# Altium project BaseController.PrjPcb
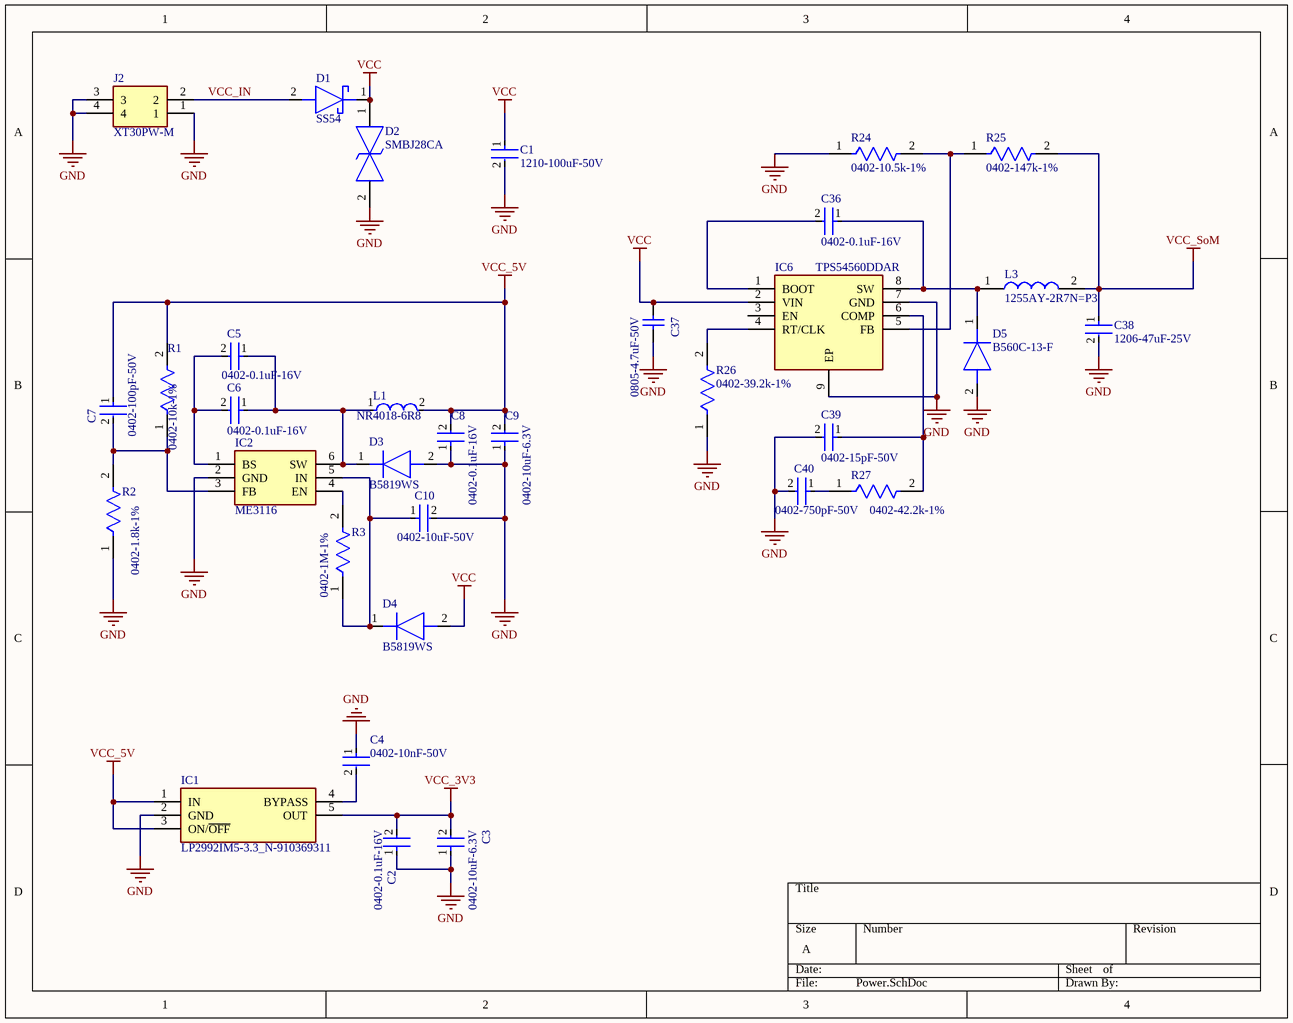
[diagram p0: Power.SchDoc]
5 sheets, 112 parts. Net scope: flat (ports and power ports of the same name join across sheets).
Board file: PCB2.PcbDoc
Sheets:
  Power.SchDoc
  ESP32.SchDoc
  CAN-POWER-B2B.SchDoc
  USB-PROG-UART.SchDoc
  Ethernet-PHY.SchDoc

## Sheet Power.SchDoc
size A; SheetNumber: 1; SheetTotal: 5

### Parts
C1  1210-100uF-50V  [FP-1210-L_3_3_0_4-W_2_5_0-IPC_B]
C2  0402-0.1uF-16V  [FP-GRM155-0_05-IPC_A]
C3  0402-10uF-6.3V  [FP-GRM155-0_05-IPC_A]
C4  0402-10nF-50V  [FP-GRM155-0_05-IPC_A]
C5  0402-0.1uF-16V  [FP-GRM155-0_05-IPC_A]
C6  0402-0.1uF-16V  [FP-GRM155-0_05-IPC_A]
C7  0402-100pF-50V  [FP-GRM155-0_05-IPC_A]
C8  0402-0.1uF-16V  [FP-GRM155-0_05-IPC_A]
C9  0402-10uF-6.3V  [FP-GRM155-0_05-IPC_A]
C10  0402-10uF-50V  [FP-GRM155-0_05-IPC_A]
C36  0402-0.1uF-16V  [FP-GRM155-0_05-IPC_A]
C37  0805-4.7uF-50V  [CAPC2013X88X50LL20T25]
C38  1206-47uF-25V  [FP-C3216-160-0_3-IPC_C]
C39  0402-15pF-50V  [FP-GRM155-0_05-IPC_A]
C40  0402-750pF-50V  [FP-GRM155-0_05-IPC_A]
D1  SS54  [DIOM5026X262N]
D2  SMBJ28CA  [DIONM5436X244N]
D3  B5819WS  [SOD2613X100N]
D4  B5819WS  [SOD2613X100N]
D5  B560C-13-F  [DIOM7959X250N]
IC1  LP2992IM5-3.3_N-910369311  [SOT95P280X145-5N]
IC2  ME3116  [SOT95P270X145-6N]
IC6  TPS54560DDAR  [SOIC127P600X170-9N]
J2  XT30PW-M  [XT30PWM]
L1  NR4018-6R8  [FP-NR4018-MFG]
L3  1255AY-2R7N=P3  [1255AY100MP3]
R1  0402-10k-1%  [FP-CRCW0402-e3-IPC_C]
R2  0402-1.8k-1%  [FP-CRCW0402-e3-IPC_C]
R3  0402-1M-1%  [FP-CRCW0402-e3-IPC_C]
R24  0402-10.5k-1%  [FP-CRCW0402-e3-IPC_C]
R25  0402-147k-1%  [FP-CRCW0402-e3-IPC_C]
R26  0402-39.2k-1%  [FP-CRCW0402-e3-IPC_C]
R27  0402-42.2k-1%  [FP-CRCW0402-e3-IPC_C]

### Nets
GND: C1.2 C2.1 C3.1 C4.1 C8.1 C9.1 C10.2 C37.1 C38.2 C39.2 C40.2 D2.2 D3.2(A) D5.2(A) IC1.2(GND) IC2.2(GND) IC6.7(GND) IC6.9(EP) J2.1 J2.3 J2.4 R2.1 R24.1 R26.1
VCC: C1.1 C37.2 D1.1(K) D2.1 D4.2(A) IC6.2(VIN)
VCC_3V3: C2.2 C3.2 IC1.5(OUT)
VCC_5V: C7.1 C8.2 C9.2 IC1.1(IN) IC1.3(ON/~{OFF}) L1.2 R1.2
VCC_SoM: C38.1 L3.2 R25.2
VCC_IN: D1.2(A) J2.2
NetC4_2: C4.2 IC1.4(BYPASS)
NetC5_1: C5.1 C6.1 D3.1(K) IC2.6(SW) L1.1
NetC5_2: C5.2 C6.2 IC2.1(BS)
NetC7_2: C7.2 IC2.3(FB) R1.1 R2.2
NetC10_1: C10.1 D4.1(K) IC2.5(IN) R3.1
NetC36_1: C36.1 D5.1(K) IC6.8(SW) L3.1
NetC36_2: C36.2 IC6.1(BOOT)
NetC39_1: C39.1 IC6.6(COMP) R27.2
NetC40_1: C40.1 R27.1
NetIC2_4: IC2.4(EN) R3.2
NetIC6_4: IC6.4(RT/CLK) R26.2
NetIC6_5: IC6.5(FB) R24.2 R25.1

Not connected (* = marked no-connect by the designer): IC6 3(EN)

### Library data of the parts
C1 = CMP-04427-007940-1: General Purpose Ceramic Capacitor, 1210, 22uF, 10%, X7R, 15%, 16V; Voltage: 10V; Insulation Resistance: 100GR; Dissipation Factor: 3.5%; REACH SVHC: No SVHC; Lead Free: Lead Free; Length: 3.2mm; Termination: SMD/SMT; Voltage Rating (DC): 16V; Radiation Hardening: No; RoHS Compliant: Yes; Case/Package: 1210; Case Code (Metric): 3225; Capacitance: 22uF; Width: 0.098inch; Packaging: Tape and Reel; Dielectric: X7R; Min Operating Temperature: -55°C; Max Operating Temperature: 125°C; Package Quantity: 1000; Series: Standard; Thickness: 0.11inch; Contact Plating: Tin; Tolerance: 10%; Height: 2.79mm; Mount: Surface Mount; Case Code (Imperial): 1210; Depth: 2.5mm; Voltage Rating: 16V; Number of Pins: 2; Construction: Flat
C2-C10 C36 C39 C40 = CMP-2008-04561-5: CAP CER 0.22UF 10V X5R 0402; Tolerance: 10%; Capacitance: 220nF; Material: Ceramic; Insulation Resistance: 10GR; Package Quantity: 1; Termination: SMD/SMT; Max Operating Temperature: 85°C; Voltage: 10V; REACH SVHC: No SVHC; Thickness: 0.022inch; Mount: Surface Mount; Height: 0.5mm; Length: 1mm; Lead Free: Lead Free; Number of Pins: 2; Case Code (Imperial): 0402; Case/Package: 0402; Min Operating Temperature: -55°C; Packaging: Tape and Reel; Dielectric: X5R; Depth: 0.5mm; Series: GRM; Case Code (Metric): 1005; Radiation Hardening: No; RoHS Compliant: Yes; Voltage Rating (DC): 10V; Voltage Rating: 10V; Dielectric Material: Ceramic; Width: 0.5mm
C37 = CMP-2007-00266-1: Manufacturer: Kemet; Part Number: C0805C103K5RACTU
C38 = CMP-2000-05396-3: Multilayer Ceramic Capacitors 100uF ±20% 10V X5R SMD 1206; Voltage Rating (DC): 10V; Length: 3.2mm; Mount: Surface Mount; Depth: 1.6mm; Width: 1.6mm; Package Quantity: 1; Min Operating Temperature: -55°C; Packaging: Tape and Reel; Max Operating Temperature: 85°C; Dielectric: X5R; Construction: Flat; Case Code (Imperial): 1206; Capacitance: 100uF; Thickness: 0.075inch; Radiation Hardening: No; RoHS Compliant: Yes; Series: C; Dielectric Material: Ceramic; Voltage: 10V; REACH SVHC: No SVHC; Case Code (Metric): 3216; Weight: 0.000571oz; Height: 1.6mm; Voltage Rating: 10V; Termination: SMD/SMT; Lead Free: Lead Free; Tolerance: 20%; Case/Package: 1206; Resistor Type: Ceramic
D1 = SS54: Schottky Diode; Manufacturer_Name: DIYI Elec Tech; Datasheet Link: https://datasheet.lcsc.com/szlcsc/DIYI-Elec-Tech-SS54_C84165.pdf; Height: 2.62mm; Manufacturer_Part_Number: SS54
D2 = SMBJ28CA: TVS Diode (Bi-directional); Manufacturer_Name: Bourns; Datasheet Link: https://componentsearchengine.com/Datasheets/1/SMBJ28CA.pdf; Height: 2.44mm; Manufacturer_Part_Number: SMBJ28CA; Mouser Part Number: 652-SMBJ28CA; Mouser Price/Stock: https://www.mouser.co.uk/ProductDetail/Bourns/SMBJ28CA?qs=d7fLapxX37FKb4yeAvm1Vg%3D%3D; Arrow Part Number: SMBJ28CA; Arrow Price/Stock: https://www.arrow.com/en/products/smbj28ca/bourns?region=nac
D3 D4 = B5819WS: Diode; Manufacturer_Name: Yangzhou Yangjie Electronic Technology Co.; Datasheet Link: https://www.21yangjie.com/ggs/xxh/xxhxtdejg/B5817WS%20THRU%20B5819WS-SOD-323-%E6%B5%B7%E9%B8%A5%E8%84%9A.pdf; Height: 1mm; Manufacturer_Part_Number: B5819WS
D5 = B560C-13-F: Diode; Manufacturer_Name: Diodes Inc.; Datasheet Link: https://datasheet.lcsc.com/szlcsc/Diodes-Incorporated-B560C-13-F_C85100.pdf; Height: 2.5mm; Manufacturer_Part_Number: B560C-13-F; Mouser Part Number: 621-B560C-F; Mouser Price/Stock: https://www.mouser.co.uk/ProductDetail/Diodes-Incorporated/B560C-13-F?qs=OC0R%252Bhozcm%252BAsjMXklZLIw%3D%3D; Arrow Part Number: B560C-13-F; Arrow Price/Stock: https://www.arrow.com/en/products/b560c-13-f/diodes-incorporated?region=nac
IC1 = LP2992IM5-3.3_N-910369311: Integrated Circuit; Manufacturer_Name: Texas Instruments; Manufacturer_Part_Number: LP2992IM5-3.3/N-910369311; Datasheet Link: https://www.arrow.com/en/products/lp2992im5-3.3n-910369311/texas-instruments; Height: 1.45mm; Arrow Part Number: LP2992IM5-3.3/N-910369311; Arrow Price/Stock: https://www.arrow.com/en/products/lp2992im5-3.3n-910369311/texas-instruments
IC2 = ME3116: Integrated Circuit; Manufacturer_Name: Microne; Datasheet Link: https://datasheet.lcsc.com/szlcsc/Nanjing-Micro-One-Elec-ME3116_C97643.pdf; Height: 1.45mm; Manufacturer_Part_Number: ME3116
IC6 = TPS54560DDAR: Integrated Circuit; Manufacturer_Name: Texas Instruments; Datasheet Link: http://www.ti.com/lit/ds/symlink/tps54560.pdf; Height: 1.7mm; Manufacturer_Part_Number: TPS54560DDAR; Mouser Part Number: 595-TPS54560DDAR; Mouser Price/Stock: https://www.mouser.co.uk/ProductDetail/Texas-Instruments/TPS54560DDAR?qs=%2FA2SZCkL4Tlm1gC5t8ZNIg%3D%3D; Arrow Part Number: TPS54560DDAR; Arrow Price/Stock: https://www.arrow.com/en/products/tps54560ddar/texas-instruments?region=nac
J2 = XT30PW-M: Connector; Manufacturer_Name: Amass; Datasheet Link: https://www.tme.eu/sl/Document/ce4077e36b79046da520ca73227e15de/XT30PW%20SPEC.pdf; Height: 5mm; Manufacturer_Part_Number: XT30PW-M
L1 = CMP-14484-000658-1: SMD Power Inductors 2.2uH ±20% 1.44A 72mΩ; Shielding: Shielded; Self Resonant Frequency: 52MHz; Core Material: Ferrite; Saturation Current: 2.7A; DC Resistance (DCR): 72mR; Test Frequency: 100kHz; Current Rating: 1.44A; Inductance: 2.2uH; RoHS Compliant: Yes; Inductance Tolerance: 20%; Max DC Current: 1.44A; Package Quantity: 3500; Termination: SMD/SMT; Width: 4mm; Tolerance: 20%; Case/Package: 1515; Lead Free: Lead Free; Height: 1.8mm; Resistor Type: Wirewound; Packaging: Tape and Reel; Mount: Surface Mount; Min Operating Temperature: -25°C; Max Operating Temperature: 120°C; Number of Pins: 2; Series: NR; RMS Current (Irms): 1.44A; Height - Seated (Max): 0.071inch; Length: 0.157inch; Halogen Free: Halogen Free
L3 = 1255AY-2R7N=P3: Inductor; Manufacturer_Name: Murata Electronics; Datasheet Link: https://psearch.en.murata.com/inductor/product/1255AY-2R7N%23.html; Height: 4.5mm; Manufacturer_Part_Number: 1255AY-2R7N=P3; Mouser Part Number: 81-1255AY-2R7NP3; Mouser Price/Stock: https://www.mouser.co.uk/ProductDetail/Murata-Electronics/1255AY-2R7N%3dP3?qs=KuGPmAKtFKXDux1CpeRnvg%3D%3D; Arrow Part Number: 1255AY-2R7N=P3; Arrow Price/Stock: https://www.arrow.com/en/products/1255ay-2r7np3/murata-manufacturing
R1-R3 R24-R27 = CMP-2002-08122-2: RES Thick Film, 0Ω, 0.063W, 0402; Tolerance: 5%; Max Power Dissipation: 63mW; Voltage Rating: 50V; Temperature Coefficient: 100ppm/°C; Resistance: 0mR; Contact Plating: Tin; Height: 0.35mm; Radiation Hardening: No; Features: Automotive AEC-Q200; Composition: Thick Film; Width: 0.5mm; Weight: 2.3E-05oz; Termination: SMD/SMT; Packaging: Tape and Reel; Mount: Surface Mount; Case Code (Metric): 1005; Military Standard: Not; Min Operating Temperature: -55°C; Number of Terminations: 2; Package Quantity: 1; Case Code (Imperial): 0402; Depth: 0.5mm; Max Operating Temperature: 155°C; Case/Package: 0402; Power Rating: 63mW; Lead Free: Lead Free; Voltage Rating (DC): 50V; Length: 1mm

## Sheet ESP32.SchDoc
size A; SheetNumber: 2; SheetTotal: 5
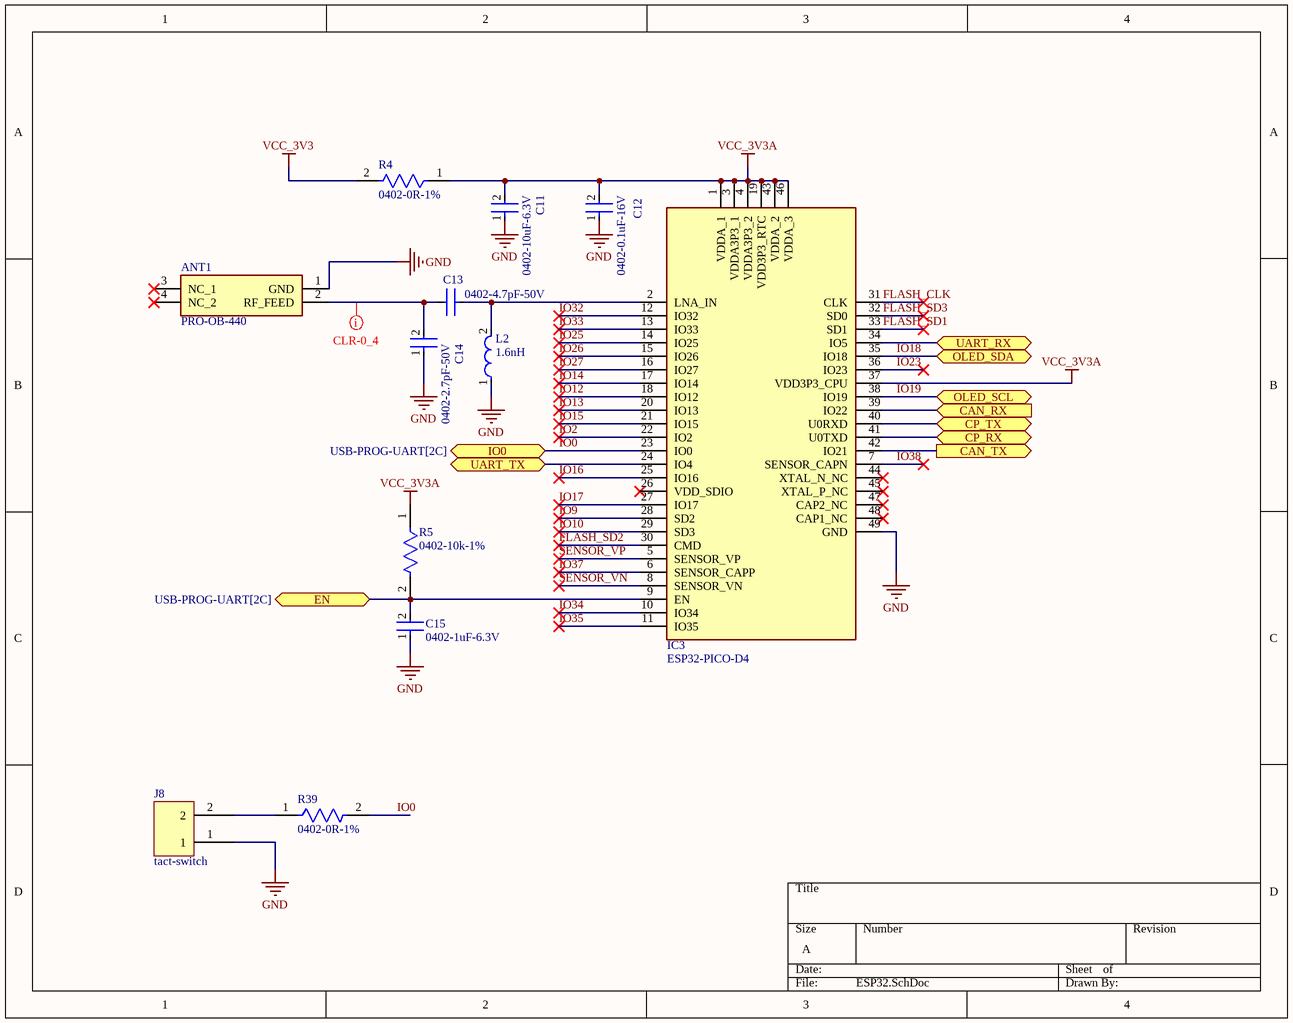
[diagram p1: ESP32.SchDoc]

### Parts
ANT1  PRO-OB-440  [PRO-OB-440_1]
C11  0402-10uF-6.3V  [FP-GRM155-0_05-IPC_A]
C12  0402-0.1uF-16V  [FP-GRM155-0_05-IPC_A]
C13  0402-4.7pF-50V  [FP-GRM155-0_05-IPC_A]
C14  0402-2.7pF-50V  [FP-GRM155-0_05-IPC_A]
C15  0402-1uF-6.3V  [FP-GRM155-0_05-IPC_A]
IC3  ESP32-PICO-D4  [ESP32PICOD4]
J8  tact-switch  [tact-switch]
L2  1.6nH  [FP-LQW15AN_00-W0_6-0_1-MFG]
R4  0402-0R-1%  [FP-CRCW0402-e3-IPC_C]
R5  0402-10k-1%  [FP-CRCW0402-e3-IPC_C]
R39  0402-0R-1%  [FP-CRCW0402-e3-IPC_C]

### Ports
CAN_RX (in, see CAN-POWER-B2B[1C]), CAN_TX (out, see CAN-POWER-B2B[1C]), CP_RX (bidir, see USB-PROG-UART[4A]), CP_TX (bidir, see USB-PROG-UART[4A]), EN (bidir, see USB-PROG-UART[2C]), IO0 (bidir, see USB-PROG-UART[2C]), OLED_SCL (bidir, see CAN-POWER-B2B[3C]), OLED_SDA (bidir, see CAN-POWER-B2B[3C]), UART_RX (bidir, see CAN-POWER-B2B[4B]), UART_TX (bidir, see CAN-POWER-B2B[4B])

### Nets
GND: ANT1.1(GND) C11.1 C12.1 C14.1 C15.1 IC3.49(GND) J8.1 L2.1
VCC_3V3: R4.2
VCC_3V3A: C11.2 C12.2 IC3.1(VDDA_1) IC3.3(VDDA3P3_1) IC3.4(VDDA3P3_2) IC3.19(VDD3P3_RTC) IC3.37(VDD3P3_CPU) IC3.43(VDDA_2) IC3.46(VDDA_3) R4.1 R5.1
FLASH_CLK: IC3.31(CLK)
FLASH_SD1: IC3.33(SD1)
FLASH_SD2: IC3.30(CMD)
FLASH_SD3: IC3.32(SD0)
IO0: IC3.23(IO0) R39.2 ; port IO0
IO2: IC3.22(IO2)
IO9: IC3.28(SD2)
IO10: IC3.29(SD3)
IO12: IC3.18(IO12)
IO13: IC3.20(IO13)
IO14: IC3.17(IO14)
IO15: IC3.21(IO15)
IO16: IC3.25(IO16)
IO17: IC3.27(IO17)
IO18: IC3.35(IO18) ; port OLED_SDA
IO19: IC3.38(IO19) ; port OLED_SCL
IO23: IC3.36(IO23)
IO25: IC3.14(IO25)
IO26: IC3.15(IO26)
IO27: IC3.16(IO27)
IO32: IC3.12(IO32)
IO33: IC3.13(IO33)
IO34: IC3.10(IO34)
IO35: IC3.11(IO35)
IO37: IC3.6(SENSOR_CAPP)
IO38: IC3.7(SENSOR_CAPN)
SENSOR_VN: IC3.8(SENSOR_VN)
SENSOR_VP: IC3.5(SENSOR_VP)
UART_RX: IC3.34(IO5) ; port UART_RX
UART_TX: IC3.24(IO4) ; port UART_TX
NetANT1_2: ANT1.2(RF_FEED) C13.2 C14.2
NetC13_1: C13.1 IC3.2(LNA_IN) L2.2
NetC15_2: C15.2 IC3.9(EN) R5.2 ; port EN
NetIC3_39: IC3.39(IO22) ; port CAN_RX
NetIC3_40: IC3.40(U0RXD) ; port CP_TX
NetIC3_41: IC3.41(U0TXD) ; port CP_RX
NetIC3_42: IC3.42(IO21) ; port CAN_TX
NetJ8_2: J8.2 R39.1

Not connected (* = marked no-connect by the designer): ANT1 3(NC_1)* 4(NC_2)*; IC3 26(VDD_SDIO)* 44(XTAL_N_NC)* 45(XTAL_P_NC)* 47(CAP2_NC)* 48(CAP1_NC)*

### Layout directives
net class CLR-0_4: NetANT1_2

### Library data of the parts
ANT1 = PRO-OB-440: Antenna; Manufacturer_Name: Proant AB; Datasheet Link: https://datasheet.datasheetarchive.com/originals/distributors/Datasheets_SAMA/948dc430b75246ce8cd38483dfecf2eb.pdf; Manufacturer_Part_Number: PRO-OB-440
C11-C15 = CMP-2008-04561-5: as C2 on sheet Power; Package Quantity: 1; Termination: SMD/SMT; Max Operating Temperature: 85°C; Voltage: 10V; REACH SVHC: No SVHC; Thickness: 0.022inch; Mount: Surface Mount; Height: 0.5mm; Length: 1mm; Lead Free: Lead Free; Number of Pins: 2; Case Code (Imperial): 0402; Case/Package: 0402; Min Operating Temperature: -55°C; Packaging: Tape and Reel; Dielectric: X5R; Depth: 0.5mm; Series: GRM; Case Code (Metric): 1005; Radiation Hardening: No; RoHS Compliant: Yes; Voltage Rating (DC): 10V; Voltage Rating: 10V; Dielectric Material: Ceramic; Width: 0.5mm
IC3 = ESP32-PICO-D4: Integrated Circuit; Manufacturer_Name: Espressif Systems; Datasheet Link: https://www.espressif.com/sites/default/files/documentation/esp32-pico-d4_datasheet_en.pdf; Height: 1.04mm; Manufacturer_Part_Number: ESP32-PICO-D4; Mouser Part Number: 356-ESP32-PICO-D4; Mouser Price/Stock: https://www.mouser.co.uk/ProductDetail/Espressif-Systems/ESP32-PICO-D4?qs=MLItCLRbWsw7MJlbN3HfdA%3D%3D
L2 = CMP-06042-000827-1: Wire Wound RF Inductor 3.9nH ±0.1nH 750mA 0.07Ω 0402 (1005); Shielding: Unshielded; Self Resonant Frequency: 10GHz; Core Material: Air; Test Frequency: 100MHz; DC Resistance (DCR): 70mR; Length: 1mm; Inductance: 3.9nH; Height: 0.5mm; Case Code (Metric): 1005; Lead Free: Lead Free; Military Standard: Not; Mount: Surface Mount; Current: 750mA; REACH SVHC: No SVHC; Current Rating: 750mA; DC Current: 750mA; Max Operating Temperature: 125°C; Package Quantity: 10000; Packaging: Tape and Reel; Case/Package: 0402; Min Operating Temperature: -55°C; Width: 0.02inch; Depth: 0.7mm; Termination: SMD/SMT; Weight: 2.8E-05oz; Number of Pins: 2; Radiation Hardening: No; Max DC Current: 750mA; Case Code (Imperial): 0402
R4 R5 R39 = CMP-2002-08122-2: as R1 on sheet Power; Contact Plating: Tin; Height: 0.35mm; Radiation Hardening: No; Features: Automotive AEC-Q200; Composition: Thick Film; Width: 0.5mm; Weight: 2.3E-05oz; Termination: SMD/SMT; Packaging: Tape and Reel; Mount: Surface Mount; Case Code (Metric): 1005; Military Standard: Not; Min Operating Temperature: -55°C; Number of Terminations: 2; Package Quantity: 1; Case Code (Imperial): 0402; Depth: 0.5mm; Max Operating Temperature: 155°C; Case/Package: 0402; Power Rating: 63mW; Lead Free: Lead Free; Voltage Rating (DC): 50V; Length: 1mm

## Sheet CAN-POWER-B2B.SchDoc
size A; SheetNumber: 3; SheetTotal: 5
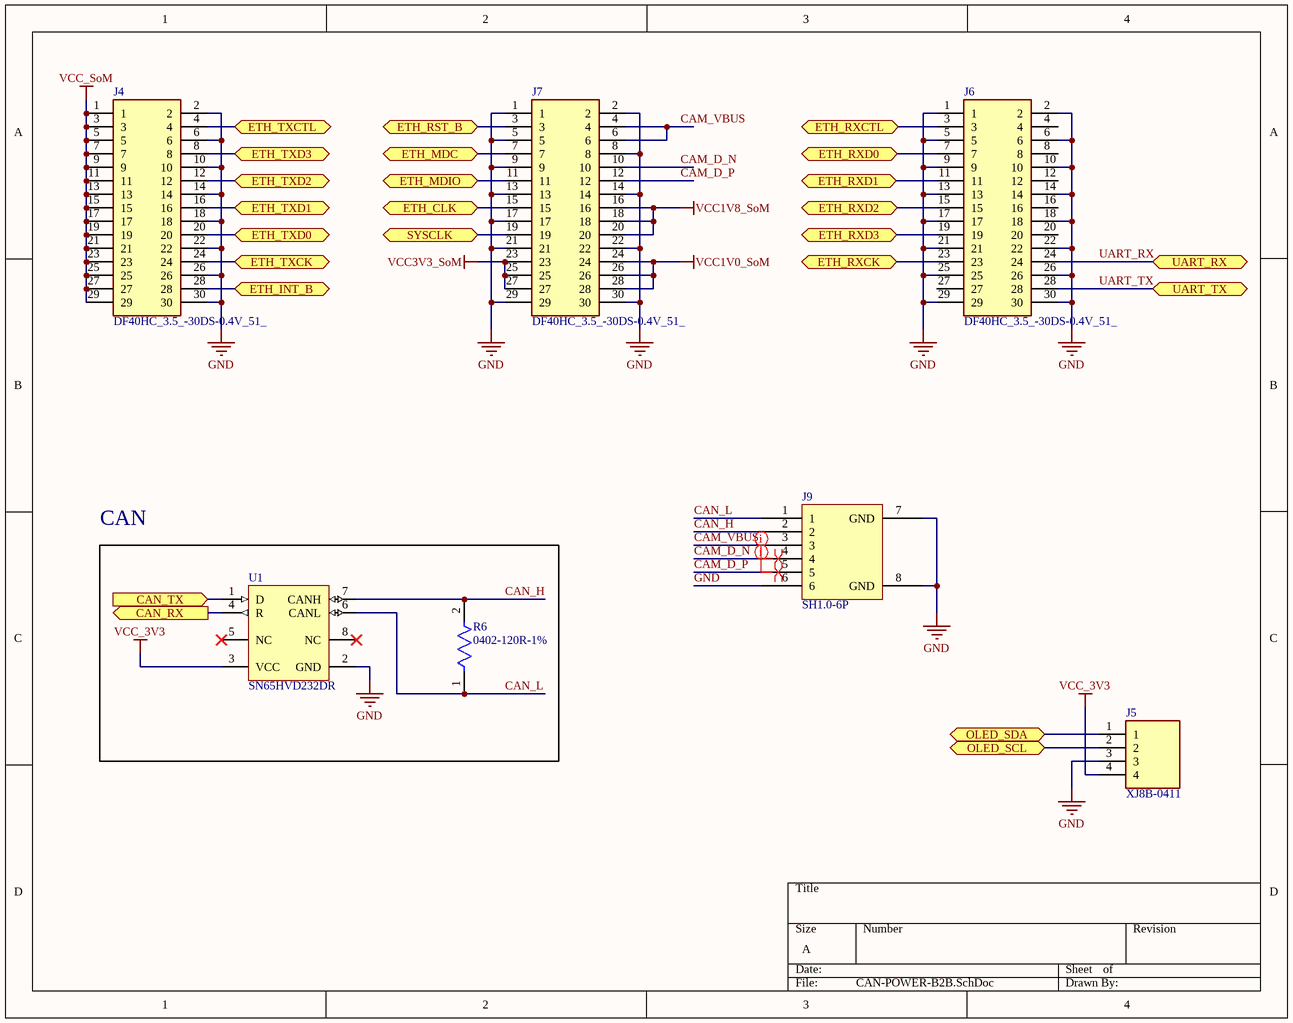
[diagram p2: CAN-POWER-B2B.SchDoc]

### Parts
J4  DF40HC_3.5_-30DS-0.4V_51_  [DF40HC3530DS04V51]
J5  XJ8B-0411  [HDRV4W64P0X254_1X4_1020X250X580P]
J6  DF40HC_3.5_-30DS-0.4V_51_  [DF40HC3530DS04V51]
J7  DF40HC_3.5_-30DS-0.4V_51_  [DF40HC3530DS04V51]
J9  SH1.0-6P  [SH1.0-6P]
R6  0402-120R-1%  [FP-CRCW0402-e3-IPC_C]
U1  SN65HVD232DR  [D0008A_M]

### Blocks framed on the sheet
CAN: R6 U1

### Ports
CAN_RX (out, see ESP32[3B]), CAN_TX (in, see ESP32[3B]), ETH_CLK (bidir, see Ethernet-PHY[1A]), ETH_INT_B (bidir, see Ethernet-PHY[1C]), ETH_MDC (bidir, see Ethernet-PHY[2B]), ETH_MDIO (bidir, see Ethernet-PHY[2B]), ETH_RST_B (bidir, see Ethernet-PHY[2B]), ETH_RXCK (bidir, see Ethernet-PHY[2D]), ETH_RXCTL (bidir, see Ethernet-PHY[2D]), ETH_RXD0 (bidir, see Ethernet-PHY[2D]), ETH_RXD1 (bidir, see Ethernet-PHY[2D]), ETH_RXD2 (bidir, see Ethernet-PHY[2D]), ETH_RXD3 (bidir, see Ethernet-PHY[2D]), ETH_TXCK (bidir, see Ethernet-PHY[2C]), ETH_TXCTL (bidir, see Ethernet-PHY[2C]), ETH_TXD0 (bidir, see Ethernet-PHY[2C]), ETH_TXD1 (bidir, see Ethernet-PHY[2C]), ETH_TXD2 (bidir, see Ethernet-PHY[2C]), ETH_TXD3 (bidir, see Ethernet-PHY[2C]), OLED_SCL (bidir, see ESP32[3B]), OLED_SDA (bidir, see ESP32[3B]), SYSCLK (bidir, see Ethernet-PHY[1A]), UART_RX (bidir, see ESP32[3B]), UART_TX (bidir, see ESP32[2B])

### Nets
GND: J4.2 J4.6 J4.10 J4.14 J4.18 J4.22 J4.26 J4.30 J5.3 J6.1 J6.2 J6.5 J6.6 J6.9 J6.10 J6.13 J6.14 J6.17 J6.18 J6.21 J6.22 J6.25 J6.26 J6.29 J6.30 J7.1 J7.2 J7.5 J7.8 J7.9 J7.13 J7.14 J7.17 J7.21 J7.22 J7.29 J7.30 J9.6 J9.7(GND) J9.8(GND) U1.2(GND)
VCC1V0_SoM: J7.24 J7.26 J7.28
VCC1V8_SoM: J7.16 J7.18 J7.20
VCC3V3_SoM: J7.23 J7.25 J7.27
VCC_3V3: J5.4 U1.3(VCC)
VCC_SoM: J4.1 J4.3 J4.5 J4.7 J4.9 J4.11 J4.13 J4.15 J4.17 J4.19 J4.21 J4.23 J4.25 J4.27 J4.29
CAM_D_N: J7.10 J9.4
CAM_D_P: J7.12 J9.5
CAM_VBUS: J7.4 J7.6 J9.3
CAN_H: J9.2 R6.2 U1.7(CANH)
CAN_L: J9.1 R6.1 U1.6(CANL)
ETH_CLK: J7.15 ; port ETH_CLK
ETH_INT_B: J4.28 ; port ETH_INT_B
ETH_MDC: J7.7 ; port ETH_MDC
ETH_MDIO: J7.11 ; port ETH_MDIO
ETH_RST_B: J7.3 ; port ETH_RST_B
ETH_RXCK: J6.23 ; port ETH_RXCK
ETH_RXCTL: J6.3 ; port ETH_RXCTL
ETH_RXD0: J6.7 ; port ETH_RXD0
ETH_RXD1: J6.11 ; port ETH_RXD1
ETH_RXD2: J6.15 ; port ETH_RXD2
ETH_RXD3: J6.19 ; port ETH_RXD3
ETH_TXCK: J4.24 ; port ETH_TXCK
ETH_TXCTL: J4.4 ; port ETH_TXCTL
ETH_TXD0: J4.20 ; port ETH_TXD0
ETH_TXD1: J4.16 ; port ETH_TXD1
ETH_TXD2: J4.12 ; port ETH_TXD2
ETH_TXD3: J4.8 ; port ETH_TXD3
IO18: J5.1 ; port OLED_SDA
IO19: J5.2 ; port OLED_SCL
SYSCLK: J7.19 ; port SYSCLK
UART_RX: J6.24 ; port UART_RX
UART_TX: J6.28 ; port UART_TX
NetIC3_39: U1.4(R) ; port CAN_RX
NetIC3_42: U1.1(D) ; port CAN_TX

Not connected (* = marked no-connect by the designer): J6 4 8 12 16 20 27; U1 5(NC)* 8(NC)*

### Layout directives
net class CAM_USB: CAM_D_N, CAM_D_P
differential pair: CAM_D_N, CAM_D_P

### Library data of the parts
J4 J6 J7 = DF40HC_3.5_-30DS-0.4V_51_: Connector; Manufacturer_Name: Hirose; Manufacturer_Part_Number: DF40HC(3.5)-30DS-0.4V(51); Datasheet Link: https://www.hirose.com/product/en/products/DF40/DF40HC%283.5%29-30DS-0.4V%2851%29/; Height: 3mm; Mouser Part Number: 798-DF40HC3530DS04V; Mouser Price/Stock: https://www.mouser.co.uk/ProductDetail/Hirose-Connector/DF40HC3.5-30DS-0.4V51?qs=sAMQa04WsV9vLKgcIJF7Vw%3D%3D
J5 = XJ8B-0411: Connector; Manufacturer_Name: Omron Electronics; Datasheet Link: https://www.omron.com/ecb/products/pdf/en-xj8.pdf; Height: 5.8mm; Manufacturer_Part_Number: XJ8B-0411; Mouser Part Number: 653-XJ8B0411; Mouser Price/Stock: https://www.mouser.co.uk/ProductDetail/Omron-Electronics/XJ8B-0411?qs=8ODJmtm206ec9SYet6om8g%3D%3D
R6 = CMP-2002-08122-2: as R1 on sheet Power; Contact Plating: Tin; Height: 0.35mm; Radiation Hardening: No; Features: Automotive AEC-Q200; Composition: Thick Film; Width: 0.5mm; Weight: 2.3E-05oz; Termination: SMD/SMT; Packaging: Tape and Reel; Mount: Surface Mount; Case Code (Metric): 1005; Military Standard: Not; Min Operating Temperature: -55°C; Number of Terminations: 2; Package Quantity: 1; Case Code (Imperial): 0402; Depth: 0.5mm; Max Operating Temperature: 155°C; Case/Package: 0402; Power Rating: 63mW; Lead Free: Lead Free; Voltage Rating (DC): 50V; Length: 1mm
U1 = CMP-0315-00075-2: 3.3 V Can Transceiver, 17 mA, -40 to 85 degC, 8-pin SOIC (D), Green (RoHS & no Sb/Br); Manufacturer: Texas Instruments; Supply Voltage(s)(V): 3.3; Receivers Per Package: 1; ICC(Max)(mA): 17; Rating: Catalog; Transient Pulse Protection(V): -25 to 25; Mounting Technology: Surface Mount; PartNumber: SN65HVD232DR; Code_JEDEC: MS-012AA; Eco-Plan: Green (RoHS & no Sb/Br); Isolated: No; SubFamily: CAN; Footprint: SN65HVD232; Drivers Per Package: 1; ComponentLink1URL: http://www.ti.com/general/docs/lit/getliterature.tsp?genericPartNumber=SN65HVD232&fileType=pdf; ComponentLink1Description: Datasheet; PackageDescription: 8-Pin Plastic Small Outline Integrated Circuit, 4.9 x 3.9 mm, Pitch 1.27 mm Pitch; PackageReference: D0008A; DatasheetVersion: SLOS346K; PackageVersion: revM, Jun-2011

## Sheet USB-PROG-UART.SchDoc
size A; SheetNumber: 4; SheetTotal: 5
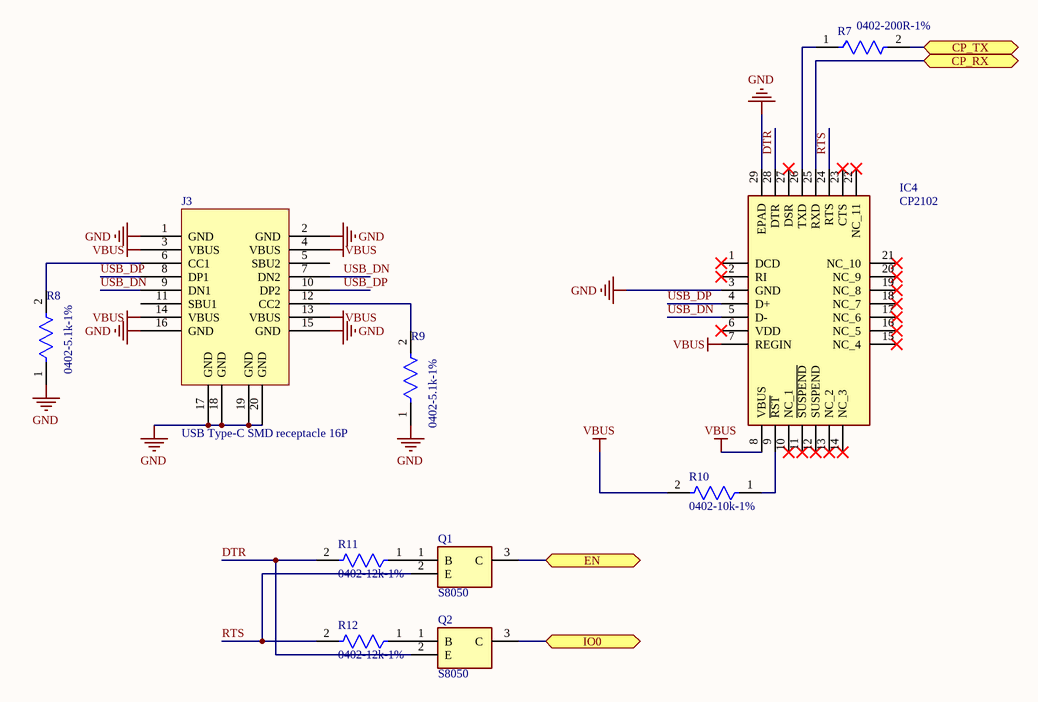
[diagram p3: USB-PROG-UART.SchDoc]

### Parts
IC4  CP2102  [QFN50P500X500X100-29N-D]
J3  USB Type-C SMD receptacle 16P  [USB Type-C SMD receptacle 16P]
Q1  S8050  [SOT95P240X115-3N]
Q2  S8050  [SOT95P240X115-3N]
R7  0402-200R-1%  [FP-CRCW0402-e3-IPC_C]
R8  0402-5.1k-1%  [FP-CRCW0402-e3-IPC_C]
R9  0402-5.1k-1%  [FP-CRCW0402-e3-IPC_C]
R10  0402-10k-1%  [FP-CRCW0402-e3-IPC_C]
R11  0402-12k-1%  [FP-CRCW0402-e3-IPC_C]
R12  0402-12k-1%  [FP-CRCW0402-e3-IPC_C]

### Ports
CP_RX (bidir, see ESP32[3B]), CP_TX (bidir, see ESP32[3B]), EN (bidir, see ESP32[1C]), IO0 (bidir, see ESP32[2B])

### Nets
GND: IC4.3(GND) IC4.29(EPAD) J3.1(GND) J3.2(GND) J3.15(GND) J3.16(GND) J3.17(GND) J3.18(GND) J3.19(GND) J3.20(GND) R8.1 R9.1
VBUS: IC4.7(REGIN) IC4.8(VBUS) J3.3(VBUS) J3.4(VBUS) J3.13(VBUS) J3.14(VBUS) R10.2
DTR: IC4.28(DTR) Q2.2(E) R11.2
IO0: Q2.3(C) ; port IO0
RTS: IC4.24(RTS) Q1.2(E) R12.2
USB_DN: IC4.5(D-) J3.7(DN2) J3.9(DN1)
USB_DP: IC4.4(D+) J3.8(DP1) J3.10(DP2)
NetC15_2: Q1.3(C) ; port EN
NetIC3_40: R7.2 ; port CP_TX
NetIC3_41: IC4.25(RXD) ; port CP_RX
NetIC4_9: IC4.9(~{RST}) R10.1
NetIC4_26: IC4.26(TXD) R7.1
NetJ3_6: J3.6(CC1) R8.2
NetJ3_12: J3.12(CC2) R9.2
NetQ1_1: Q1.1(B) R11.1
NetQ2_1: Q2.1(B) R12.1

Not connected (* = marked no-connect by the designer): IC4 1(DCD)* 2(RI)* 6(VDD)* 10(NC_1)* 11(~{SUSPEND})* 12(SUSPEND)* 13(NC_2)* 14(NC_3)* 15(NC_4)* 16(NC_5)* 17(NC_6)* 18(NC_7)* 19(NC_8)* 20(NC_9)* 21(NC_10)* 22(NC_11)* 23(CTS)* 27(DSR)*; J3 5(SBU2) 11(SBU1)

### Library data of the parts
IC4 = CP2102: Integrated Circuit; Manufacturer_Name: Silicon Labs; Datasheet Link: https://componentsearchengine.com/Datasheets/1/CP2102.pdf; Height: 1mm; Manufacturer_Part_Number: CP2102; Mouser Part Number: 634-CP2102; Mouser Price/Stock: https://www.mouser.co.uk/ProductDetail/Silicon-Labs/CP2102?qs=ucY0lxHzU7615lOm95XT0w%3D%3D
Q1 Q2 = S8050: Transistor; Manufacturer_Name: Yenji Elec; Datasheet Link: https://datasheet.lcsc.com/szlcsc/Yenji-Elec-S8050_C139514.pdf; Height: 1.15mm; Manufacturer_Part_Number: S8050
R7-R12 = CMP-2002-08122-2: as R1 on sheet Power; Contact Plating: Tin; Height: 0.35mm; Radiation Hardening: No; Features: Automotive AEC-Q200; Composition: Thick Film; Width: 0.5mm; Weight: 2.3E-05oz; Termination: SMD/SMT; Packaging: Tape and Reel; Mount: Surface Mount; Case Code (Metric): 1005; Military Standard: Not; Min Operating Temperature: -55°C; Number of Terminations: 2; Package Quantity: 1; Case Code (Imperial): 0402; Depth: 0.5mm; Max Operating Temperature: 155°C; Case/Package: 0402; Power Rating: 63mW; Lead Free: Lead Free; Voltage Rating (DC): 50V; Length: 1mm

## Sheet Ethernet-PHY.SchDoc
size A4; SheetNumber: 5; SheetTotal: 5
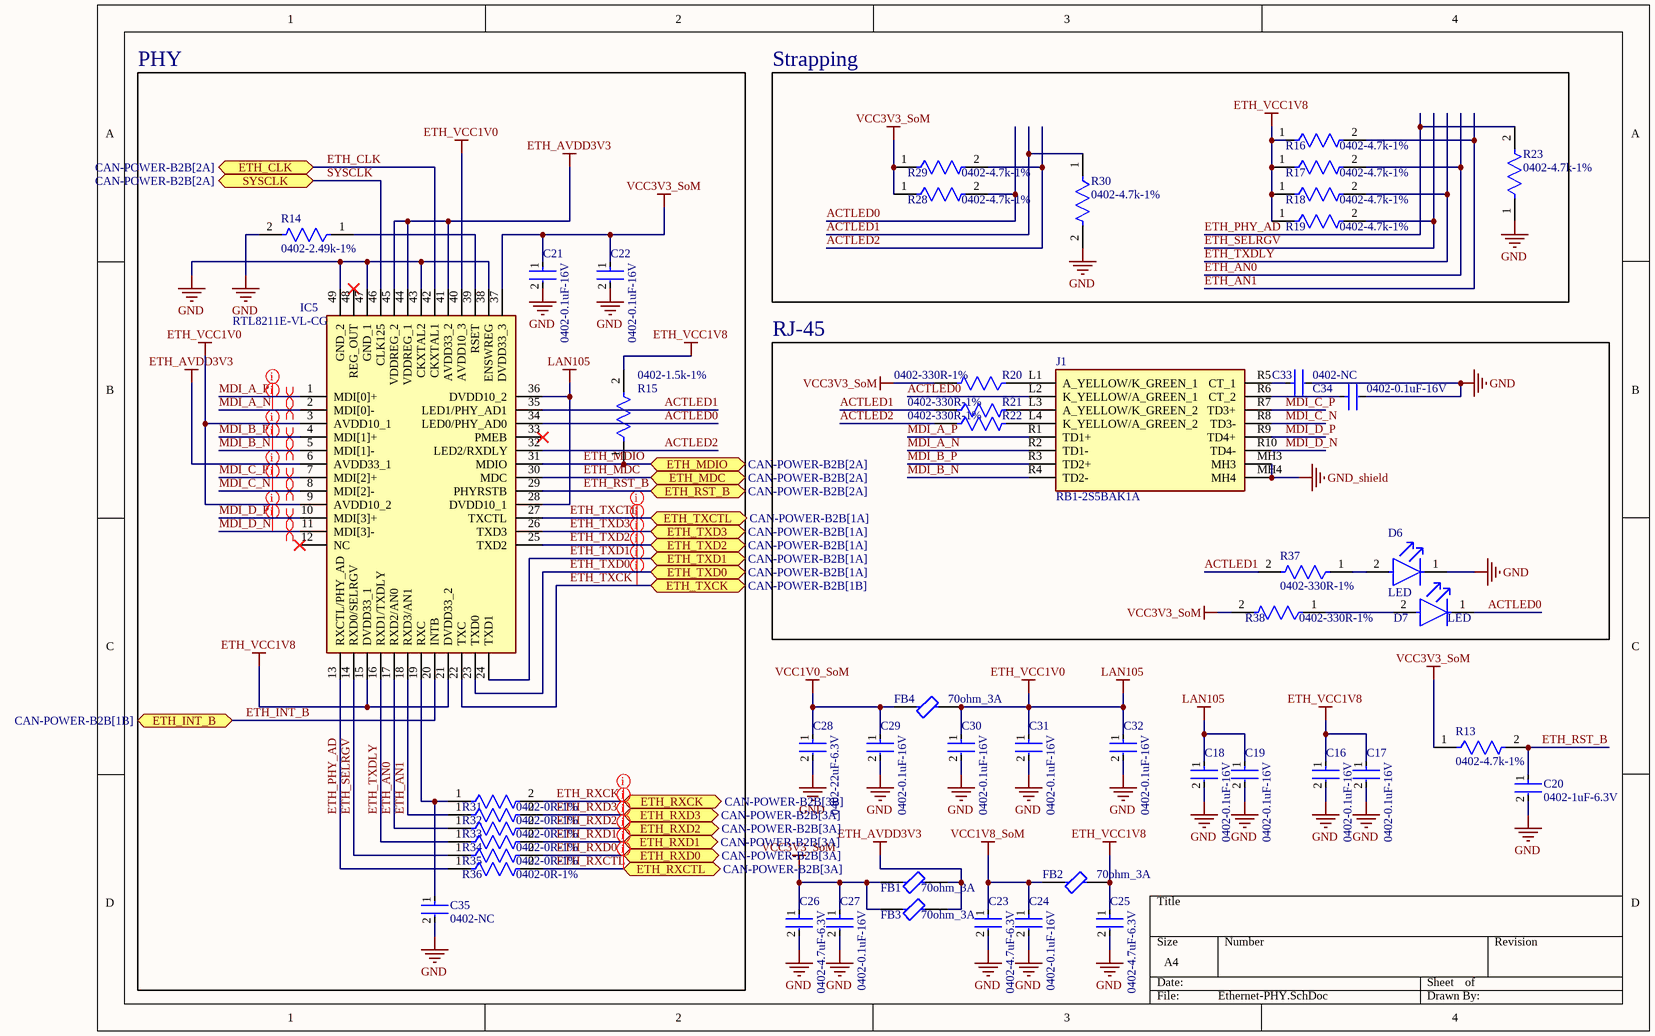
[diagram p4: Ethernet-PHY.SchDoc]

### Parts
C16  0402-0.1uF-16V  [FP-GRM155-0_05-IPC_A]
C17  0402-0.1uF-16V  [FP-GRM155-0_05-IPC_A]
C18  0402-0.1uF-16V  [FP-GRM155-0_05-IPC_A]
C19  0402-0.1uF-16V  [FP-GRM155-0_05-IPC_A]
C20  0402-1uF-6.3V  [FP-GRM155-0_05-IPC_A]
C21  0402-0.1uF-16V  [FP-GRM155-0_05-IPC_A]
C22  0402-0.1uF-16V  [FP-GRM155-0_05-IPC_A]
C23  0402-4.7uF-6.3V  [FP-GRM155-0_05-IPC_A]
C24  0402-0.1uF-16V  [FP-GRM155-0_05-IPC_A]
C25  0402-4.7uF-6.3V  [FP-GRM155-0_05-IPC_A]
C26  0402-4.7uF-6.3V  [FP-GRM155-0_05-IPC_A]
C27  0402-0.1uF-16V  [FP-GRM155-0_05-IPC_A]
C28  0402-22uF-6.3V  [FP-GRM155-0_05-IPC_A]
C29  0402-0.1uF-16V  [FP-GRM155-0_05-IPC_A]
C30  0402-0.1uF-16V  [FP-GRM155-0_05-IPC_A]
C31  0402-0.1uF-16V  [FP-GRM155-0_05-IPC_A]
C32  0402-0.1uF-16V  [FP-GRM155-0_05-IPC_A]
C33  0402-NC  [FP-GRM155-0_05-IPC_A]
C34  0402-0.1uF-16V  [FP-GRM155-0_05-IPC_A]
C35  0402-NC  [FP-GRM155-0_05-IPC_A]
D6  LED  [FP-APHHS1005CGCK-MFG]
D7  LED  [FP-APHHS1005CGCK-MFG]
FB1  70ohm_3A  [FP-MPZ2012-MFG]
FB2  70ohm_3A  [FP-MPZ2012-MFG]
FB3  70ohm_3A  [FP-MPZ2012-MFG]
FB4  70ohm_3A  [FP-MPZ2012-MFG]
IC5  RTL8211E-VL-CG  [QFN40P600X600X100-49N]
J1  RB1-2S5BAK1A  [RB12S5BAK1A]
R13  0402-4.7k-1%  [FP-CRCW0402-e3-IPC_C]
R14  0402-2.49k-1%  [FP-CRCW0402-e3-IPC_C]
R15  0402-1.5k-1%  [FP-CRCW0402-e3-IPC_C]
R16  0402-4.7k-1%  [FP-CRCW0402-e3-IPC_C]
R17  0402-4.7k-1%  [FP-CRCW0402-e3-IPC_C]
R18  0402-4.7k-1%  [FP-CRCW0402-e3-IPC_C]
R19  0402-4.7k-1%  [FP-CRCW0402-e3-IPC_C]
R20  0402-330R-1%  [FP-CRCW0402-e3-IPC_C]
R21  0402-330R-1%  [FP-CRCW0402-e3-IPC_C]
R22  0402-330R-1%  [FP-CRCW0402-e3-IPC_C]
R23  0402-4.7k-1%  [FP-CRCW0402-e3-IPC_C]
R28  0402-4.7k-1%  [FP-CRCW0402-e3-IPC_C]
R29  0402-4.7k-1%  [FP-CRCW0402-e3-IPC_C]
R30  0402-4.7k-1%  [FP-CRCW0402-e3-IPC_C]
R31  0402-0R-1%  [FP-CRCW0402-e3-IPC_C]
R32  0402-0R-1%  [FP-CRCW0402-e3-IPC_C]
R33  0402-0R-1%  [FP-CRCW0402-e3-IPC_C]
R34  0402-0R-1%  [FP-CRCW0402-e3-IPC_C]
R35  0402-0R-1%  [FP-CRCW0402-e3-IPC_C]
R36  0402-0R-1%  [FP-CRCW0402-e3-IPC_C]
R37  0402-330R-1%  [FP-CRCW0402-e3-IPC_C]
R38  0402-330R-1%  [FP-CRCW0402-e3-IPC_C]

### Blocks framed on the sheet
PHY: C21 C22 C35 IC5 R14 R15 R31-R36
Strapping: R16-R19 R23 R28-R30
RJ-45: C33 C34 D6 D7 J1 R20-R22 R37 R38

### Ports
ETH_CLK (bidir, see CAN-POWER-B2B[2A]), ETH_INT_B (bidir, see CAN-POWER-B2B[1B]), ETH_MDC (bidir, see CAN-POWER-B2B[2A]), ETH_MDIO (bidir, see CAN-POWER-B2B[2A]), ETH_RST_B (bidir, see CAN-POWER-B2B[2A]), ETH_RXCK (bidir, see CAN-POWER-B2B[3B]), ETH_RXCTL (bidir, see CAN-POWER-B2B[3A]), ETH_RXD0 (bidir, see CAN-POWER-B2B[3A]), ETH_RXD1 (bidir, see CAN-POWER-B2B[3A]), ETH_RXD2 (bidir, see CAN-POWER-B2B[3A]), ETH_RXD3 (bidir, see CAN-POWER-B2B[3A]), ETH_TXCK (bidir, see CAN-POWER-B2B[1B]), ETH_TXCTL (bidir, see CAN-POWER-B2B[1A]), ETH_TXD0 (bidir, see CAN-POWER-B2B[1A]), ETH_TXD1 (bidir, see CAN-POWER-B2B[1A]), ETH_TXD2 (bidir, see CAN-POWER-B2B[1A]), ETH_TXD3 (bidir, see CAN-POWER-B2B[1A]), SYSCLK (bidir, see CAN-POWER-B2B[2A])

### Nets
ETH_AVDD3V3: FB1.2 FB3.2 IC5.6(AVDD33_1) IC5.41(AVDD33_2) IC5.44(VDDREG_1) IC5.45(VDDREG_2)
ETH_VCC1V0: C18.1 C19.1 C30.1 C31.1 C32.1 FB4.2 IC5.3(AVDD10_1) IC5.9(AVDD10_2) IC5.28(DVDD10_1) IC5.36(DVDD10_2) IC5.40(AVDD10_3)  [also labelled LAN105]
ETH_VCC1V8: C16.1 C17.1 C25.1 FB2.2 IC5.15(DVDD33_1) IC5.21(DVDD33_2) R15.2 R16.1 R17.1 R18.1 R19.1
GND: C16.2 C17.2 C18.2 C19.2 C20.2 C21.2 C22.2 C23.2 C24.2 C25.2 C26.2 C27.2 C28.2 C29.2 C30.2 C31.2 C32.2 C33.2 C34.2 C35.2 D6.1(C) IC5.38(ENSWREG) IC5.43(CKXTAL2) IC5.47(GND_1) IC5.49(GND_2) R14.2 R23.1 R30.2
GND_shield: J1.MH3 J1.MH4
VCC1V0_SoM: C28.1 C29.1 FB4.1
VCC1V8_SoM: C23.1 C24.1 FB2.1
VCC3V3_SoM: C21.1 C22.1 C26.1 C27.1 FB1.1 FB3.1 IC5.37(DVDD33_3) R13.1 R20.2 R28.1 R29.1 R38.2
ACTLED0: D7.1(C) IC5.34(LED0/PHY_AD0) J1.L2(K_YELLOW/A_GREEN_1) R28.2
ACTLED1: IC5.35(LED1/PHY_AD1) R21.1 R30.1 R37.2
ACTLED2: IC5.32(LED2/RXDLY) R22.1 R29.2
ETH_AN0: IC5.17(RXD2/AN0) R17.2 R33.1
ETH_AN1: IC5.18(RXD3/AN1) R16.2 R32.1
ETH_CLK: IC5.42(CKXTAL1) ; port ETH_CLK
ETH_INT_B: IC5.20(INTB) ; port ETH_INT_B
ETH_MDC: IC5.30(MDC) ; port ETH_MDC
ETH_MDIO: IC5.31(MDIO) R15.1 ; port ETH_MDIO
ETH_PHY_AD: IC5.13(RXCTL/PHY_AD) R23.2 R36.1
ETH_RST_B: C20.1 IC5.29(PHYRSTB) R13.2 ; port ETH_RST_B
ETH_RXCK: R31.2 ; port ETH_RXCK
ETH_RXCTL: R36.2 ; port ETH_RXCTL
ETH_RXD0: R35.2 ; port ETH_RXD0
ETH_RXD1: R34.2 ; port ETH_RXD1
ETH_RXD2: R33.2 ; port ETH_RXD2
ETH_RXD3: R32.2 ; port ETH_RXD3
ETH_SELRGV: IC5.14(RXD0/SELRGV) R19.2 R35.1
ETH_TXCK: IC5.22(TXC) ; port ETH_TXCK
ETH_TXCTL: IC5.27(TXCTL) ; port ETH_TXCTL
ETH_TXD0: IC5.23(TXD0) ; port ETH_TXD0
ETH_TXD1: IC5.24(TXD1) ; port ETH_TXD1
ETH_TXD2: IC5.25(TXD2) ; port ETH_TXD2
ETH_TXD3: IC5.26(TXD3) ; port ETH_TXD3
ETH_TXDLY: IC5.16(RXD1/TXDLY) R18.2 R34.1
MDI_A_N: IC5.2(MDI[0]-) J1.R2(TD1-)
MDI_A_P: IC5.1(MDI[0]+) J1.R1(TD1+)
MDI_B_N: IC5.5(MDI[1]-) J1.R4(TD2-)
MDI_B_P: IC5.4(MDI[1]+) J1.R3(TD2+)
MDI_C_N: IC5.8(MDI[2]-) J1.R8(TD3-)
MDI_C_P: IC5.7(MDI[2]+) J1.R7(TD3+)
MDI_D_N: IC5.11(MDI[3]-) J1.R10(TD4-)
MDI_D_P: IC5.10(MDI[3]+) J1.R9(TD4+)
SYSCLK: IC5.46(CLK125) ; port SYSCLK
NetC33_1: C33.1 J1.R5(CT_1)
NetC34_1: C34.1 J1.R6(CT_2)
NetC35_1: C35.1 IC5.19(RXC) R31.1
NetD6_2: D6.2(A) R37.1
NetD7_2: D7.2(A) R38.1
NetIC5_39: IC5.39(RSET) R14.1
NetJ1_L1: J1.L1(A_YELLOW/K_GREEN_1) R20.1
NetJ1_L3: J1.L3(A_YELLOW/K_GREEN_2) R21.2
NetJ1_L4: J1.L4(K_YELLOW/A_GREEN_2) R22.2

Not connected (* = marked no-connect by the designer): IC5 12(NC)* 33(PMEB)* 48(REG_OUT)*

### Layout directives
differential pair: MDI_A_N, MDI_A_P, MDI_B_N, MDI_B_P, MDI_C_N, MDI_C_P, MDI_D_N, MDI_D_P
net class MDI: MDI_A_N, MDI_A_P, MDI_B_N, MDI_B_P, MDI_C_N, MDI_C_P, MDI_D_N, MDI_D_P
net class RGMII-TX: ETH_TXCK, ETH_TXCTL, ETH_TXD0, ETH_TXD1, ETH_TXD2, ETH_TXD3
net class RGMII-RX: ETH_RXCK, ETH_RXCTL, ETH_RXD0, ETH_RXD1, ETH_RXD2, ETH_RXD3

### Library data of the parts
C16-C35 = CMP-2008-04561-5: as C2 on sheet Power; Package Quantity: 1; Termination: SMD/SMT; Max Operating Temperature: 85°C; Voltage: 10V; REACH SVHC: No SVHC; Thickness: 0.022inch; Mount: Surface Mount; Height: 0.5mm; Length: 1mm; Lead Free: Lead Free; Number of Pins: 2; Case Code (Imperial): 0402; Case/Package: 0402; Min Operating Temperature: -55°C; Packaging: Tape and Reel; Dielectric: X5R; Depth: 0.5mm; Series: GRM; Case Code (Metric): 1005; Radiation Hardening: No; RoHS Compliant: Yes; Voltage Rating (DC): 10V; Voltage Rating: 10V; Dielectric Material: Ceramic; Width: 0.5mm
D6 D7 = CMP-44529-000044-1: LED GREEN CLEAR CHIP SMD; Viewing Angle: 120°; Dominant Wavelength: 570nm; Test Current: 20mA; Luminous Intensity: 50mcd; Forward Voltage: 2.1V; Number of LEDs: 1; Lens Color: Clear; Packaging: Tape and Reel; Max Operating Temperature: 85°C; Illumination Color: Green; Length: 1mm; Mount: Surface Mount; Lens Style: Clear; Color: Green; Number of Pins: 2; Wavelength: 570nm; Case/Package: 0402; Width: 0.5mm; Package Quantity: 2000; Case Code (Metric): 1005; Height: 0.6mm; Lead Free: Lead Free; Case Code (Imperial): 0402; Forward Current: 20mA; Min Operating Temperature: -40°C
FB1-FB4 = CMP-08257-000020-1: FERRITE BEAD 220 OHM 0805 1LN; Test Frequency: 100MHz; Max DC Current: 3A; Tolerance: 25%; Impedance: 220R; DC Resistance (DCR): 40mR; Case/Package: 0805; Mount: Surface Mount; Termination: SMD/SMT; Packaging: Tape and Reel; Core Material: Ferrite; Case Code (Metric): 2012; Length: 0.079inch; Width: 0.049inch; Case Code (Imperial): 0805; REACH SVHC: No SVHC; Weight: 0.000194oz; Current Rating: 3A; Min Operating Temperature: -55°C; Lead Free: Lead Free; Package Quantity: 4000; Max Operating Temperature: 125°C; RoHS Compliant: Yes; Depth: 1.25mm; Height: 0.85mm
IC5 = RTL8211E-VL-CG: Integrated Circuit; Manufacturer_Name: Realtek; Datasheet Link: https://datasheet.lcsc.com/lcsc/1810010421_Realtek-Semicon-RTL8211E-VB-CG_C90735.pdf; Height: 1mm; Manufacturer_Part_Number: RTL8211E-VL-CG
J1 = RB1-2S5BAK1A: Connector; Manufacturer_Name: UDE Corp; Datasheet Link: https://datasheet.lcsc.com/lcsc/1912111437_UDE-Corp-RB1-2S5BAK1A_C363232.pdf; Height: 13.6mm; Manufacturer_Part_Number: RB1-2S5BAK1A
R13-R23 R28-R38 = CMP-2002-08122-2: as R1 on sheet Power; Contact Plating: Tin; Height: 0.35mm; Radiation Hardening: No; Features: Automotive AEC-Q200; Composition: Thick Film; Width: 0.5mm; Weight: 2.3E-05oz; Termination: SMD/SMT; Packaging: Tape and Reel; Mount: Surface Mount; Case Code (Metric): 1005; Military Standard: Not; Min Operating Temperature: -55°C; Number of Terminations: 2; Package Quantity: 1; Case Code (Imperial): 0402; Depth: 0.5mm; Max Operating Temperature: 155°C; Case/Package: 0402; Power Rating: 63mW; Lead Free: Lead Free; Voltage Rating (DC): 50V; Length: 1mm

## Nets that join several sheets
GND: Power (24 pins), ESP32 (8 pins), CAN-POWER-B2B (41 pins), USB-PROG-UART (12 pins), Ethernet-PHY (28 pins)
VCC1V0_SoM: CAN-POWER-B2B (J7.24 J7.26 J7.28), Ethernet-PHY (C28.1 C29.1 FB4.1)
VCC1V8_SoM: CAN-POWER-B2B (J7.16 J7.18 J7.20), Ethernet-PHY (C23.1 C24.1 FB2.1)
VCC3V3_SoM: CAN-POWER-B2B (J7.23 J7.25 J7.27), Ethernet-PHY (12 pins)
VCC_3V3: Power (C2.2 C3.2 IC1.5), ESP32 (R4.2), CAN-POWER-B2B (J5.4 U1.3)
VCC_SoM: Power (C38.1 L3.2 R25.2), CAN-POWER-B2B (15 pins)
ETH_CLK: CAN-POWER-B2B (J7.15), Ethernet-PHY (IC5.42)
ETH_INT_B: CAN-POWER-B2B (J4.28), Ethernet-PHY (IC5.20)
ETH_MDC: CAN-POWER-B2B (J7.7), Ethernet-PHY (IC5.30)
ETH_MDIO: CAN-POWER-B2B (J7.11), Ethernet-PHY (IC5.31 R15.1)
ETH_RST_B: CAN-POWER-B2B (J7.3), Ethernet-PHY (C20.1 IC5.29 R13.2)
ETH_RXCK: CAN-POWER-B2B (J6.23), Ethernet-PHY (R31.2)
ETH_RXCTL: CAN-POWER-B2B (J6.3), Ethernet-PHY (R36.2)
ETH_RXD0: CAN-POWER-B2B (J6.7), Ethernet-PHY (R35.2)
ETH_RXD1: CAN-POWER-B2B (J6.11), Ethernet-PHY (R34.2)
ETH_RXD2: CAN-POWER-B2B (J6.15), Ethernet-PHY (R33.2)
ETH_RXD3: CAN-POWER-B2B (J6.19), Ethernet-PHY (R32.2)
ETH_TXCK: CAN-POWER-B2B (J4.24), Ethernet-PHY (IC5.22)
ETH_TXCTL: CAN-POWER-B2B (J4.4), Ethernet-PHY (IC5.27)
ETH_TXD0: CAN-POWER-B2B (J4.20), Ethernet-PHY (IC5.23)
ETH_TXD1: CAN-POWER-B2B (J4.16), Ethernet-PHY (IC5.24)
ETH_TXD2: CAN-POWER-B2B (J4.12), Ethernet-PHY (IC5.25)
ETH_TXD3: CAN-POWER-B2B (J4.8), Ethernet-PHY (IC5.26)
IO0: ESP32 (IC3.23 R39.2), USB-PROG-UART (Q2.3)
IO18: ESP32 (IC3.35), CAN-POWER-B2B (J5.1)
IO19: ESP32 (IC3.38), CAN-POWER-B2B (J5.2)
NetC15_2: ESP32 (C15.2 IC3.9 R5.2), USB-PROG-UART (Q1.3)
NetIC3_39: ESP32 (IC3.39), CAN-POWER-B2B (U1.4)
NetIC3_40: ESP32 (IC3.40), USB-PROG-UART (R7.2)
NetIC3_41: ESP32 (IC3.41), USB-PROG-UART (IC4.25)
NetIC3_42: ESP32 (IC3.42), CAN-POWER-B2B (U1.1)
SYSCLK: CAN-POWER-B2B (J7.19), Ethernet-PHY (IC5.46)
UART_RX: ESP32 (IC3.34), CAN-POWER-B2B (J6.24)
UART_TX: ESP32 (IC3.24), CAN-POWER-B2B (J6.28)